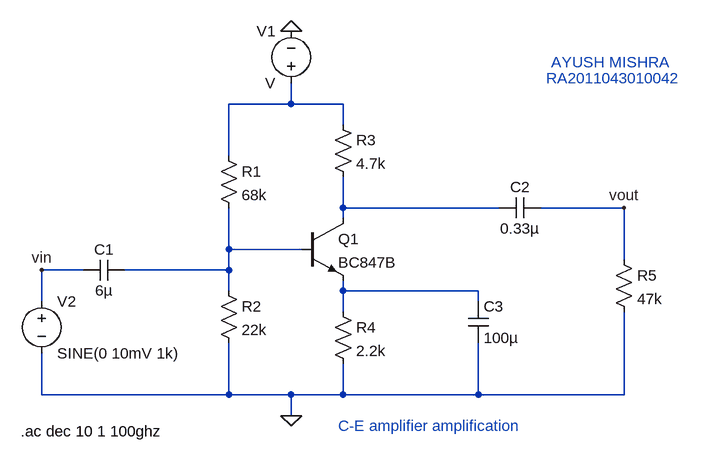
[diagram p0: schematic Draft1.asc]
Draft1.asc, the LTspice schematic file:
Version 4
SHEET 1 988 680
WIRE 368 -96 368 -128
WIRE 368 -96 272 -96
WIRE 448 -96 368 -96
WIRE 448 -64 448 -96
WIRE 272 -16 272 -96
WIRE 448 64 448 16
WIRE 688 64 448 64
WIRE 880 64 752 64
WIRE 448 80 448 64
WIRE 272 128 272 64
WIRE 384 128 272 128
WIRE 880 144 880 64
WIRE 48 160 -16 160
WIRE 272 160 272 128
WIRE 272 160 112 160
WIRE 272 192 272 160
WIRE 448 192 448 176
WIRE 656 192 448 192
WIRE -16 208 -16 160
WIRE 656 208 656 192
WIRE 448 224 448 192
WIRE -16 352 -16 288
WIRE 272 352 272 272
WIRE 272 352 -16 352
WIRE 368 352 272 352
WIRE 448 352 448 304
WIRE 448 352 368 352
WIRE 656 352 656 272
WIRE 656 352 448 352
WIRE 880 352 880 224
WIRE 880 352 656 352
WIRE 368 384 368 352
FLAG 368 384 0
FLAG 880 64 vout
FLAG -16 160 vin
FLAG 368 -208 0
SYMBOL res 256 -32 R0
SYMATTR InstName R1
SYMATTR Value 68k
SYMBOL res 256 176 R0
SYMATTR InstName R2
SYMATTR Value 22k
SYMBOL cap 112 144 R90
WINDOW 0 0 32 VBottom 2
WINDOW 3 32 32 VTop 2
SYMATTR InstName C1
SYMATTR Value 6µ
SYMBOL cap 752 48 R90
WINDOW 0 0 32 VBottom 2
WINDOW 3 32 32 VTop 2
SYMATTR InstName C2
SYMATTR Value 0.33µ
SYMBOL res 432 -80 R0
SYMATTR InstName R3
SYMATTR Value 4.7k
SYMBOL res 864 128 R0
SYMATTR InstName R5
SYMATTR Value 47k
SYMBOL cap 640 208 R0
SYMATTR InstName C3
SYMATTR Value 100µ
SYMBOL res 432 208 R0
SYMATTR InstName R4
SYMATTR Value 2.2k
SYMBOL voltage -16 192 R0
WINDOW 123 0 0 Left 0
WINDOW 39 0 0 Left 0
SYMATTR InstName V2
SYMATTR Value SINE(0 10mV 1k)
SYMBOL npn 384 80 R0
SYMATTR InstName Q1
SYMATTR Value BC847B
SYMBOL voltage 368 -112 R180
WINDOW 0 24 96 Left 2
WINDOW 3 24 16 Left 2
SYMATTR InstName V1
TEXT -48 408 Left 2 !.ac dec 10 1 100ghz
TEXT 768 -160 Left 2 ;AYUSH MISHRA
TEXT 760 -136 Left 2 ;RA2011043010042
TEXT 440 400 Left 2 ;C-E amplifier amplification

The netlist it stands for:
* Draft1.asc
R1 N001 N003 68k
R2 N003 0 22k
C1 N003 vin 6µ
C2 vout N002 0.33µ
R3 N001 N002 4.7k
R5 vout 0 47k
C3 N004 0 100µ
R4 N004 0 2.2k
V2 vin 0 SINE(0 10mV 1k)
Q1 N002 N003 N004 0 BC847B
V1 N001 0 V
.model NPN NPN
.model PNP PNP
.lib standard.bjt
.ac dec 10 1 100ghz
* AYUSH MISHRA
* RA2011043010042
* C-E amplifier amplification
.backanno
.end